# EAGLE design door (EAGLE 5.11)
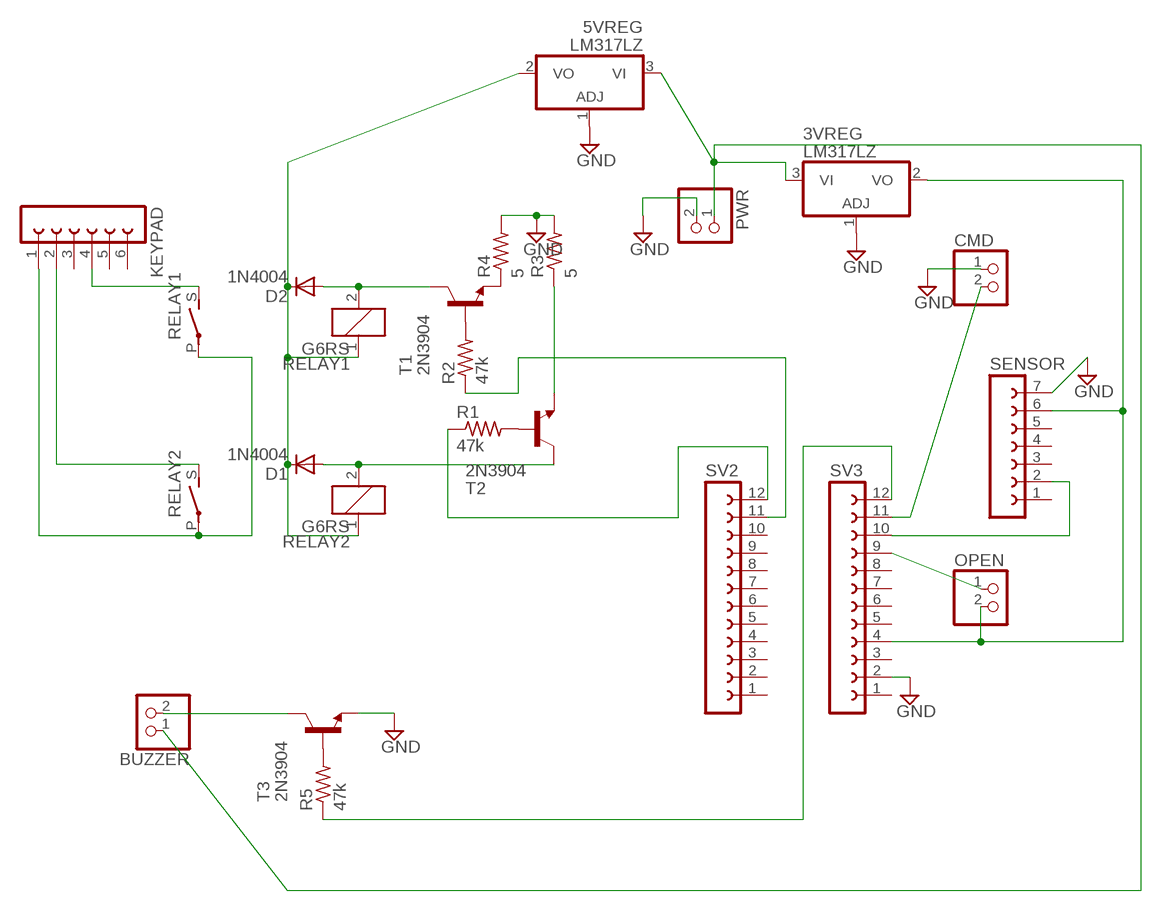
[diagram p0: schematic, sheet 1]

## Parts
3VREG  LM317LZ  [TO92]
5VREG  LM317LZ  [TO92]
BUZZER  PINHD-1X2  [1X02]
CMD  PINHD-1X2  [1X02]
D1  1N4004  [DO41-10]
D2  1N4004  [DO41-10]
KEYPAD  FE06-1  [FE06]
OPEN  PINHD-1X2  [1X02]
PWR  PINHD-1X2  [1X02]
R1  47k  R-US_0204/7  [0204/7]
R2  47k  R-US_0204/7  [0204/7]
R3  5  R-US_0204/7  [0204/7]
R4  5  R-US_0204/7  [0204/7]
R5  47k  R-US_0204/7  [0204/7]
RELAY1  G6RS  [G6RS]
RELAY2  G6RS  [G6RS]
SENSOR  FE07-1  [FE07]
SV2  FE12-1  [FE12]
SV3  FE12-1  [FE12]
T1  2N3904  [TO92]
T2  2N3904  [TO92]
T3  2N3904  [TO92]

## Nets
3.3V: 3VREG.2(VO) OPEN.2 SENSOR.6 SV3.4
5V: 5VREG.2(VO) D1.C D2.C RELAY1.1 RELAY2.1
12V: 3VREG.3(VI) 5VREG.3(VI) BUZZER.1 PWR.1
BZR: R5.1 SV3.12
BZR2: BUZZER.2 T3.1(C)
CMD: CMD.2 SV3.11
GND: 3VREG.1(ADJ) 5VREG.1(ADJ) CMD.1 PWR.2 R3.2 R4.2 SENSOR.7 SV3.2 T3.3(E)
K+: KEYPAD.1 RELAY1.P(2:P) RELAY2.P(2:P)
KLOCK: KEYPAD.2 RELAY2.S(2:S)
KUNLOCK: KEYPAD.4 RELAY1.S(2:S)
LOCK: R1.1 SV2.12
LOCK2: R1.2 T2.2(B)
LOCK3: D1.A RELAY2.2 T2.1(C)
LOCK4: R3.1 T2.3(E)
N$16: R5.2 T3.2(B)
OPEN: OPEN.1 SV3.9
RNG: SENSOR.2 SV3.10
UNLOCK: R2.1 SV2.11
UNLOCK2: R2.2 T1.2(B)
UNLOCK3: D2.A RELAY1.2 T1.1(C)
UNLOCK4: R4.1 T1.3(E)
Unconnected: KEYPAD.3 KEYPAD.5 KEYPAD.6 SENSOR.1 SENSOR.3 SENSOR.4 SENSOR.5 SV2.1 SV2.2 SV2.3 SV2.4 SV2.5 SV2.6 SV2.7 SV2.8 SV2.9 SV2.10 SV3.1 SV3.3 SV3.5 SV3.6 SV3.7 SV3.8

## Library data of the parts
3VREG 5VREG = linear:*317: Positive VOLTAGE REGULATOR
BUZZER CMD OPEN PWR = pinhead:PINHD-1X2: PIN HEADER
D1 D2 = diode:1N4004: DIODE general purpose rectifier, 1 A
KEYPAD = con-lsta:FE06-1: FEMALE HEADER; OC_FARNELL: unknown; OC_NEWARK: unknown
R1-R5 = resistor:R-US_: RESISTOR, American symbol
RELAY1 RELAY2 = relay:G6RS: RELAY 1 x norm. open, Omron; OC_FARNELL: unknown; OC_NEWARK: unknown
SENSOR = con-lsta:FE07-1: FEMALE HEADER; OC_FARNELL: unknown; OC_NEWARK: unknown
SV2 SV3 = con-lsta:FE12-1: FEMALE HEADER; OC_FARNELL: unknown; OC_NEWARK: unknown
T1-T3 = transistor:2N3904: NPN TRANSISTOR

## Board
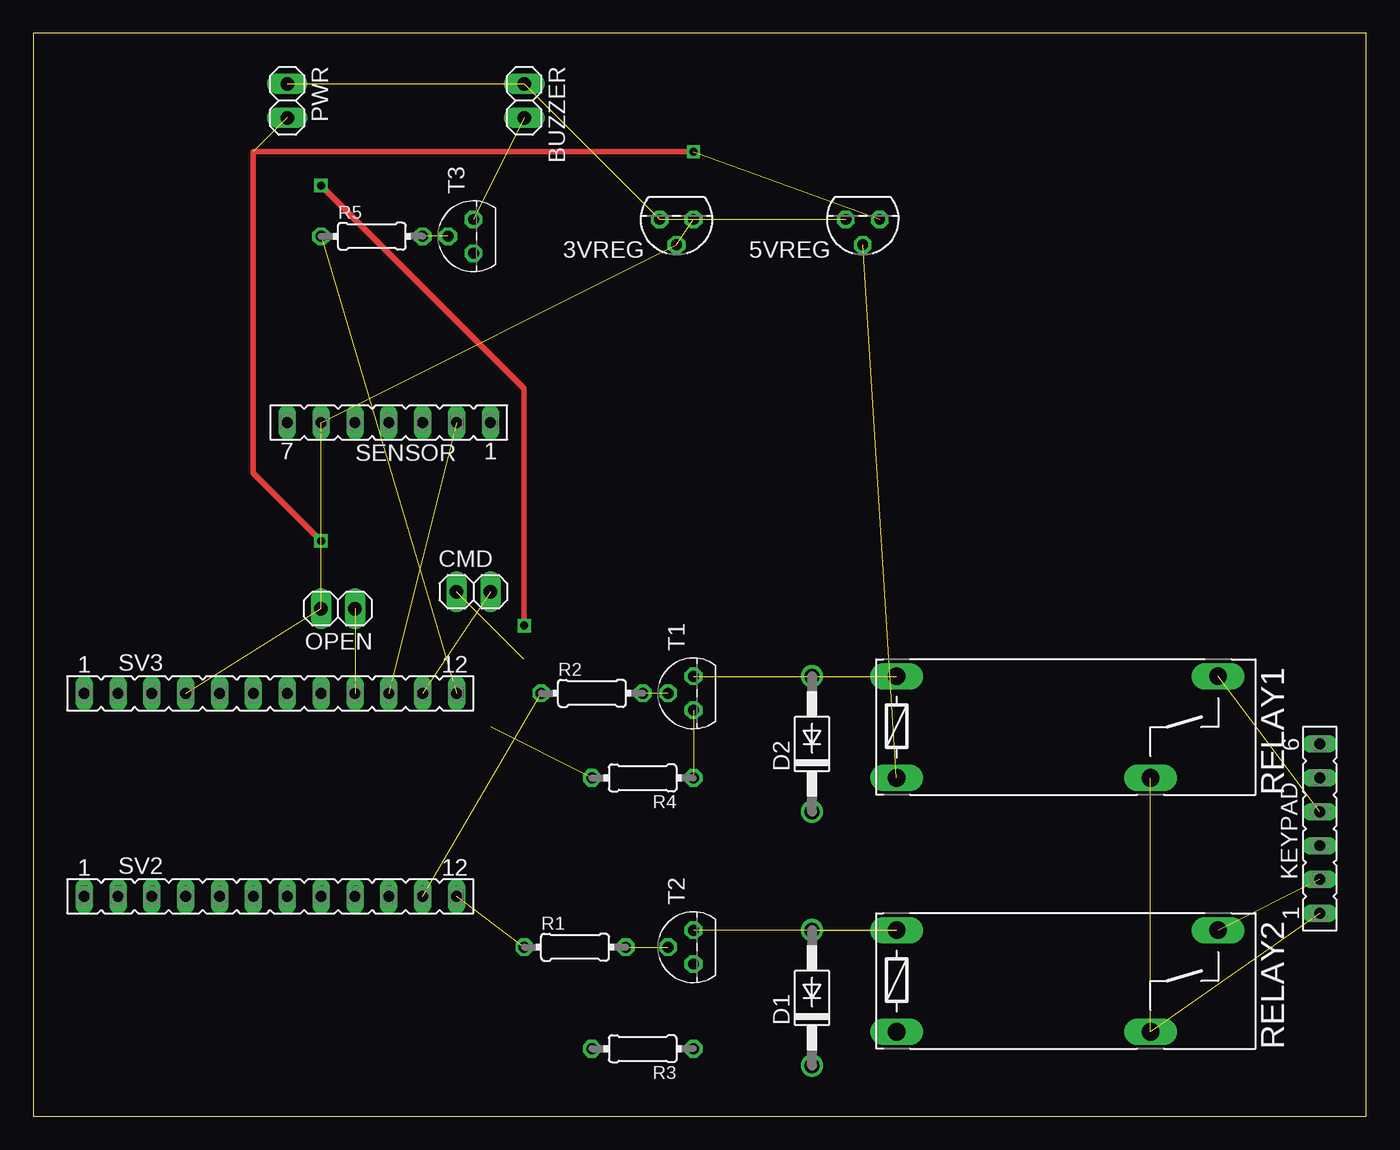
[diagram p1: board, top side]
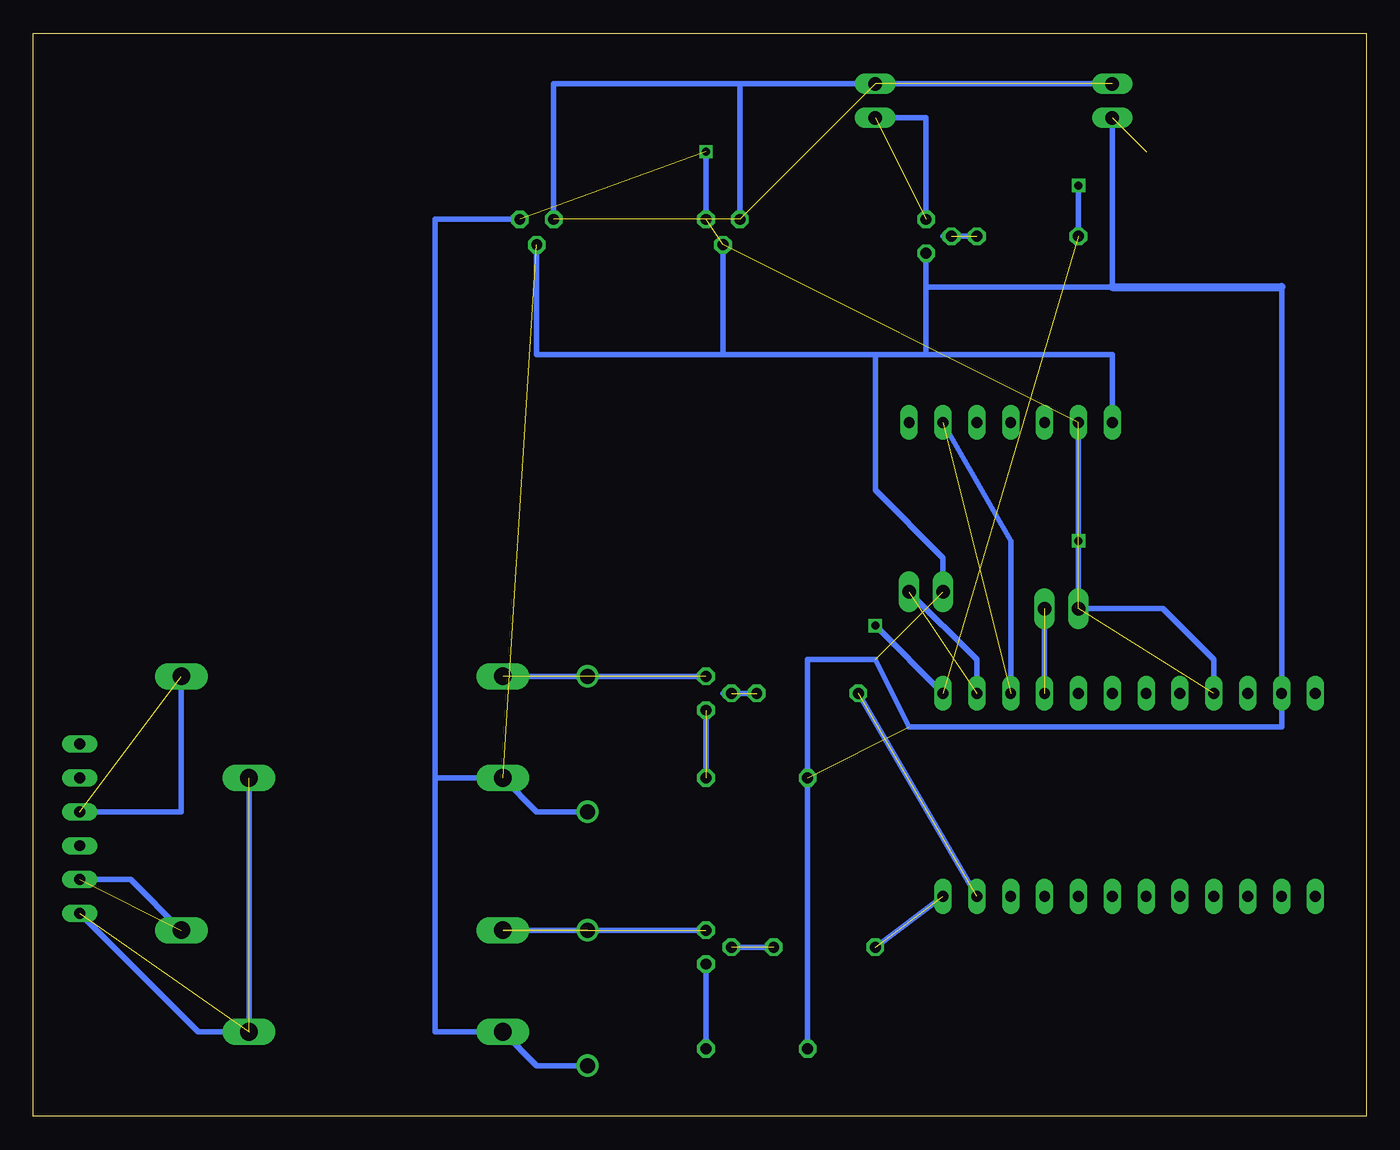
[diagram p2: board, bottom side, seen from below]

Size 100 x 81.27 mm. Coordinates in mm from the lower left corner, seen from the top.
Outline: 0,0 100,0 100,81.27 0,81.27 0,0
Copper layers (1*16): Top 0.035mm / dielectric 1.5mm / Bottom 0.035mm
Design rules "default": minimum track width 10mil, minimum drill 24mil, track to track 8mil, track to pad 8mil, pad to pad 8mil, via to via 8mil, smd to smd 8mil, copper to edge 40mil, drill to drill 8mil, minimum pad ring 10mil, minimum via ring 8mil, stop-mask expansion 4mil, vias tented up to drill 0mil, thermal gap 10mil

### Footprints (pad centres in the part's own frame; a part is rotated, then mirrored left to right if it is on the bottom)
TO92 = drill 0.813 octagon: 1 -1.27,0; 2 0,1.905; 3 1.27,0
1X02 = drill 1.016 long: 1 -1.27,0; 2 1.27,0
DO41-10 = drill 1.118 round: A 5.08,0; C -5.08,0
FE06 = drill 0.813 long: 1 -6.35,0; 2 -3.81,0; 3 -1.27,0; 4 1.27,0; 5 3.81,0; 6 6.35,0
0204/7 = drill 0.813 octagon: 1 -3.81,0; 2 3.81,0
G6RS = drill 1.321 long: 1 -12.7,-3.81; 2 -12.7,3.81; P 6.35,-3.81; S 11.43,3.81
FE07 = drill 0.813 long: 1 -7.62,0; 2 -5.08,0; 3 -2.54,0; 4 0,0; 5 2.54,0; 6 5.08,0; 7 7.62,0
FE12 = drill 0.813 long: 1 -13.97,0; 2 -11.43,0; 3 -8.89,0; 4 -6.35,0; 5 -3.81,0; 6 -1.27,0; 7 1.27,0; 8 3.81,0; 9 6.35,0; 10 8.89,0; 11 11.43,0; 12 13.97,0
TO92' = drill 0.813 octagon: 1 1.27,0; 2 0,1.905; 3 -1.27,0

### Placement (x,y rotation side)
3VREG  48.26,67.31 180 top
5VREG  62.23,67.31 180 top
BUZZER  36.83,76.2 270 top
CMD  33.02,39.37 0 top
D1  58.42,8.89 90 top
D2  58.42,27.94 90 top
KEYPAD  96.52,21.59 90 top
OPEN  22.86,38.1 180 top
PWR  19.05,76.2 270 top
R1  40.64,12.7 0 top
R2  41.91,31.75 0 top
R3  45.72,5.08 180 top
R4  45.72,25.4 180 top
R5  25.4,66.04 0 top
RELAY1  77.47,29.21 0 top
RELAY2  77.47,10.16 0 top
SENSOR  26.67,52.07 180 top
SV2  17.78,16.51 0 top
SV3  17.78,31.75 0 top
T1  2N3904  [TO92']  49.53,31.75 90 top
T2  2N3904  [TO92']  49.53,12.7 90 top
T3  2N3904  [TO92']  33.02,66.04 90 top

### Tracks (layer width: path | path; a pad name or v marks a point on that pad's centre or on a via)
3.3V  (via drill 0.6)  (3 unrouted)
  Bottom 0.406: SENSOR.6 v21.59,43.18 OPEN.2 15.24,38.1 11.43,34.29 SV3.4
5V  (1 unrouted)
  Bottom 0.406: D2.C 62.23,22.86 RELAY1.1 69.85,25.4 | D1.C 62.23,3.81 RELAY2.1 69.85,6.35 69.85,25.4 | 48.26,65.41 48.26,57.15 62.23,57.15 5VREG.2 | 69.85,25.4 69.85,67.31
12V  (3 unrouted)
  Bottom 0.406: PWR.1 BUZZER.1 46.99,77.47 | 3VREG.3 46.99,77.47 | 46.99,77.47 60.96,77.47 5VREG.3
BZR  (via drill 0.6)  (1 unrouted)
  Top 0.406: v21.59,69.85 36.83,54.61 v36.83,36.83
  Bottom 0.406: SV3.12 v36.83,36.83 | R5.1 v21.59,69.85
BZR2  (1 unrouted)
  Bottom 0.406: T3.1 33.02,74.93 BUZZER.2
CMD  (1 unrouted)
  Bottom 0.406: CMD.2 29.21,34.29 SV3.11
GND  (via drill 0.6)  (5 unrouted)
  Top 0.406: v49.53,72.39 16.51,72.39 16.51,48.26 21.59,43.18
  Bottom 0.406: 36.83,57.15 48.26,57.15 48.26,65.41 | 5VREG.1 69.85,67.31 | v49.53,72.39 3VREG.1 | SENSOR.7 19.05,57.15 33.02,57.15 | 33.02,57.15 33.02,62.23 | 36.83,57.15 33.02,57.15 | 36.83,57.15 36.83,46.99 31.75,41.91 CMD.1 | 6.35,62.23 SV3.2 6.35,29.21 34.29,29.21 36.83,34.29 41.91,34.29 R4.2 R3.2 | 33.02,62.23 T3.3 | 33.02,62.23 19.05,62.23 PWR.2
  Bottom 0.61: 19.05,62.23 6.35,62.23
K+  (2 unrouted)
  Bottom 0.406: KEYPAD.1 87.63,6.35 RELAY2.P RELAY1.P
KLOCK  (1 unrouted)
  Bottom 0.406: RELAY2.S 92.71,17.78 KEYPAD.2
KUNLOCK  (1 unrouted)
  Bottom 0.406: KEYPAD.4 88.9,22.86 RELAY1.S
LOCK  (1 unrouted)
  Bottom 0.406: SV2.12 R1.1
LOCK2  (1 unrouted)
  Bottom 0.406: R1.2 46.99,12.7
LOCK3  (2 unrouted)
  Bottom 0.406: RELAY2.2 D1.A T2.1
LOCK4
  Bottom 0.406: R3.1 T2.3
N$16  (1 unrouted)
  Bottom 0.406: R5.2 31.75,66.04
OPEN  (1 unrouted)
  Bottom 0.406: OPEN.1 SV3.9
RNG  (1 unrouted)
  Bottom 0.406: SENSOR.2 26.67,43.18 SV3.10
UNLOCK  (1 unrouted)
  Bottom 0.406: SV2.11 R2.1
UNLOCK2  (1 unrouted)
  Bottom 0.406: R2.2 46.99,31.75 48.26,31.75
UNLOCK3  (2 unrouted)
  Bottom 0.406: RELAY1.2 D2.A T1.1
UNLOCK4  (1 unrouted)
  Bottom 0.406: T1.3 R4.1